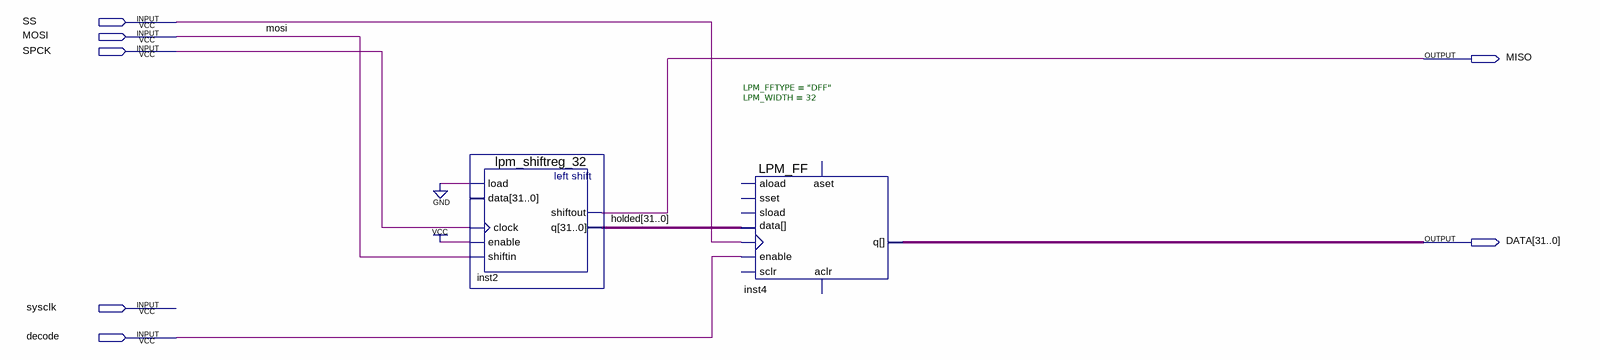
[diagram p0: schematic sheet]
// Quartus schematic spislave_async.bdf as structural Verilog: 2 symbols, 7 pins
module spislave_async (
  input  SS,
  input  MOSI,
  input  SPCK,
  input  sysclk,
  input  decode,
  output MISO,
  output [31:0] DATA
);

  wire [31:0] holded;

  lpm_shiftreg_32 inst2 (
    .load(1'b0), .clock(SPCK), .enable(1'b1), .shiftin(MOSI), .shiftout(MISO), .q(holded));  // open: data
  LPM_FF #(.LPM_FFTYPE("DFF"), .LPM_WIDTH(32)) inst4 (
    .clock(SS), .data(holded), .enable(decode), .q(DATA));  // open: aclr, aload, aset, sclr, sload, sset
endmodule
